# Altium schematic sheet Board_Kabin_shematic.SchDoc
size A
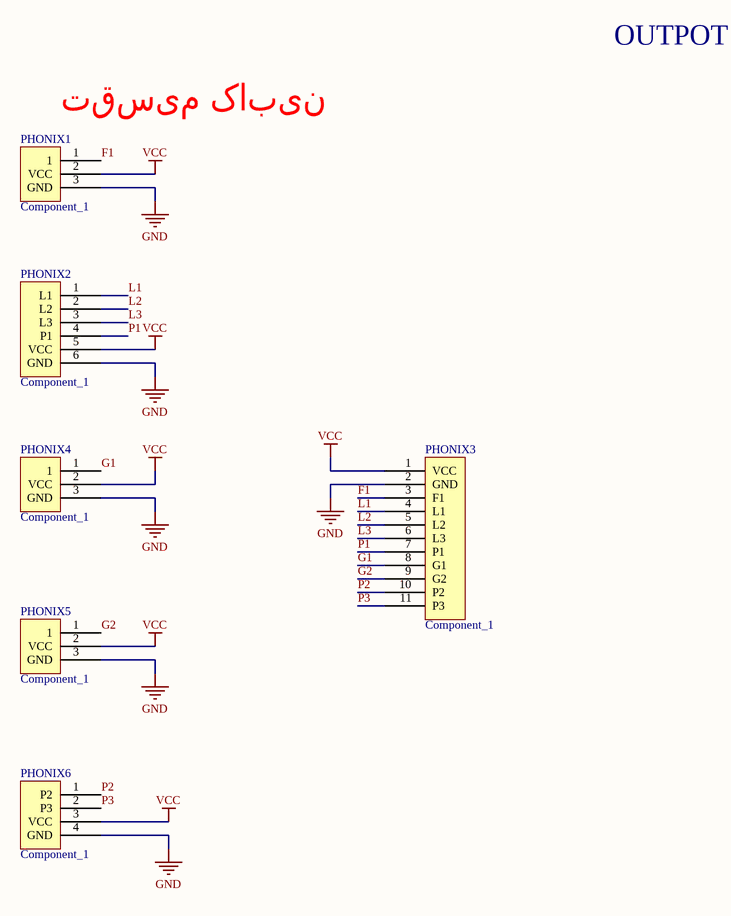
[diagram p0: Board_Kabin_shematic.SchDoc]

## Parts
PHONIX1  Component_1  [PHONIX3]
PHONIX2  Component_1  [PHONIX5]
PHONIX3  Component_1  [PHONIX11]
PHONIX4  Component_1  [PHONIX3]
PHONIX5  Component_1  [PHONIX3]
PHONIX6  Component_1  [PHONIX4]

## Nets
GND: PHONIX1.3(GND) PHONIX2.6(GND) PHONIX3.2(GND) PHONIX4.3(GND) PHONIX5.3(GND) PHONIX6.4(GND)
VCC: PHONIX1.2(VCC) PHONIX2.5(VCC) PHONIX3.1(VCC) PHONIX4.2(VCC) PHONIX5.2(VCC) PHONIX6.3(VCC)
F1: PHONIX1.1 PHONIX3.3(F1)
G1: PHONIX3.8(G1) PHONIX4.1
G2: PHONIX3.9(G2) PHONIX5.1
L1: PHONIX2.1(L1) PHONIX3.4(L1)
L2: PHONIX2.2(L2) PHONIX3.5(L2)
L3: PHONIX2.3(L3) PHONIX3.6(L3)
P1: PHONIX2.4(P1) PHONIX3.7(P1)
P2: PHONIX3.10(P2) PHONIX6.1(P2)
P3: PHONIX3.11(P3) PHONIX6.2(P3)

## Notes on the sheet
- OUTPOT
- (near PHONIX1) تقسیم کابین

## Library data of the parts
PHONIX1 PHONIX4 PHONIX5 = Component_1: PHONIX3PIN DIP
PHONIX3 = Component_1: PHONIX 11 PIN DIP